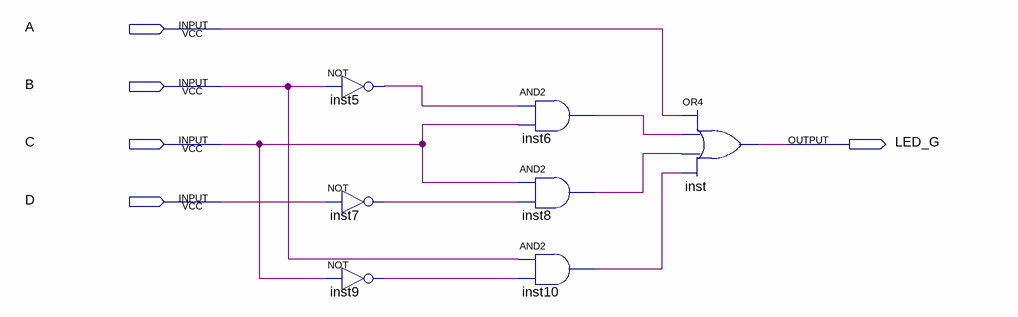
[diagram p0: schematic sheet]
// Quartus schematic led_g.bdf as structural Verilog: 7 symbols, 5 pins
module led_g (
  input  A,
  input  B,
  input  C,
  input  D,
  output LED_G
);

  wire inst5_out, inst6_out, inst7_out, inst8_out, inst9_out, inst10_out;

  not inst5 (inst5_out, B);
  not inst7 (inst7_out, D);
  not inst9 (inst9_out, C);
  and inst6 (inst6_out, inst5_out, C);
  and inst8 (inst8_out, C, inst7_out);
  and inst10 (inst10_out, B, inst9_out);
  or inst (LED_G, A, inst6_out, inst8_out, inst10_out);
endmodule
